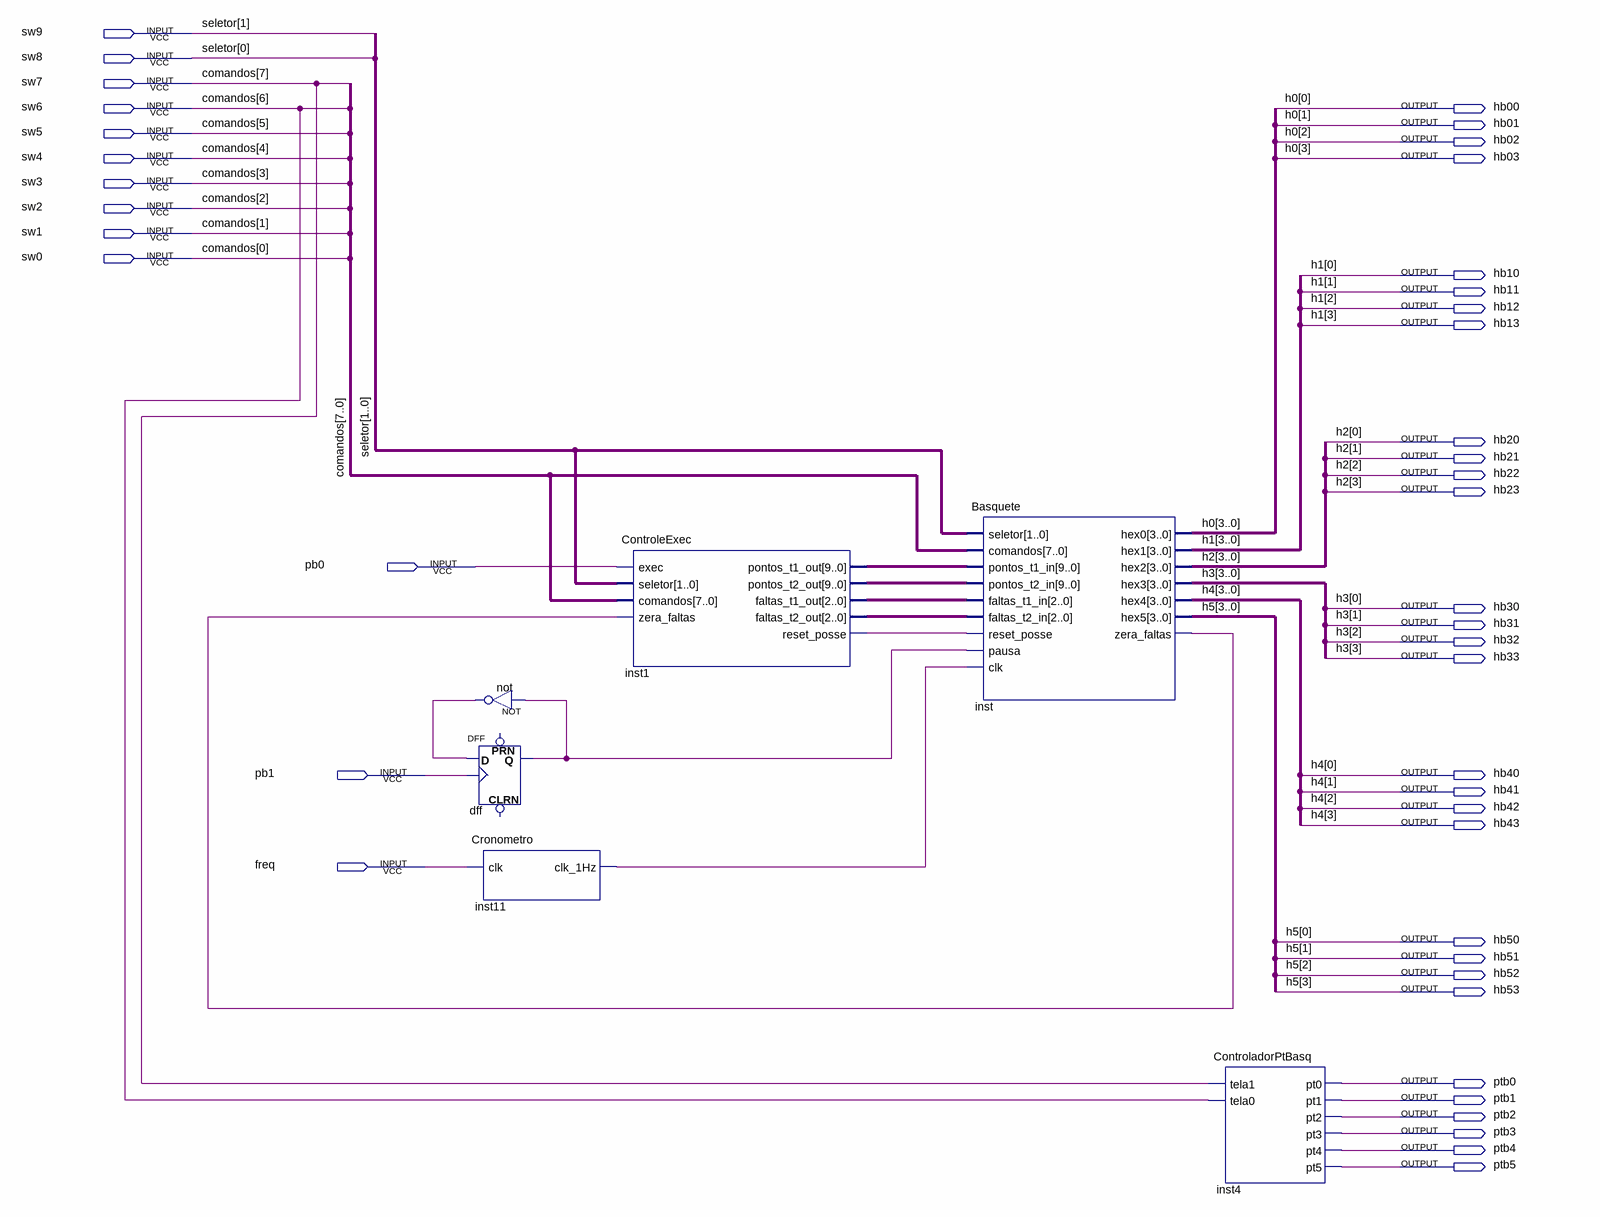
[diagram p0: schematic sheet]
// Quartus schematic ControleBasquete.bdf as structural Verilog: 6 symbols, 43 pins
module ControleBasquete (
  input  sw9,
  input  sw8,
  input  sw7,
  input  sw6,
  input  sw5,
  input  sw4,
  input  sw3,
  input  sw2,
  input  sw1,
  input  sw0,
  input  pb0,
  input  pb1,
  input  freq,
  output hb00,
  output hb01,
  output hb02,
  output hb03,
  output hb10,
  output hb11,
  output hb12,
  output hb13,
  output hb20,
  output hb21,
  output hb22,
  output hb23,
  output hb30,
  output hb31,
  output hb32,
  output hb33,
  output hb40,
  output hb41,
  output hb42,
  output hb43,
  output hb50,
  output hb51,
  output hb52,
  output hb53,
  output ptb0,
  output ptb1,
  output ptb2,
  output ptb3,
  output ptb4,
  output ptb5
);

  wire dff_q, inst1_reset_posse, inst11_clk_1hz, inst_zera_faltas, not_out;
  wire [2:0] inst1_faltas_t1_out, inst1_faltas_t2_out;
  wire [9:0] inst1_pontos_t1_out, inst1_pontos_t2_out;

  not \not  (not_out, dff_q);
  DFF dff (.CLK(pb1), .D(not_out), .Q(dff_q));  // open: CLRN, PRN
  Cronometro inst11 (.clk(freq), .clk_1Hz(inst11_clk_1hz));
  ControleExec inst1 (
    .exec(pb0), .seletor({sw9, sw8}), .comandos({sw7, sw6, sw5, sw4, sw3, sw2, sw1, sw0}),
    .zera_faltas(inst_zera_faltas), .pontos_t1_out(inst1_pontos_t1_out), .pontos_t2_out(inst1_pontos_t2_out),
    .faltas_t1_out(inst1_faltas_t1_out), .faltas_t2_out(inst1_faltas_t2_out), .reset_posse(inst1_reset_posse));
  Basquete inst (
    .seletor({sw9, sw8}), .comandos({sw7, sw6, sw5, sw4, sw3, sw2, sw1, sw0}),
    .pontos_t1_in(inst1_pontos_t1_out), .pontos_t2_in(inst1_pontos_t2_out),
    .faltas_t1_in(inst1_faltas_t1_out), .faltas_t2_in(inst1_faltas_t2_out), .reset_posse(inst1_reset_posse),
    .pausa(dff_q), .clk(inst11_clk_1hz), .hex0({hb03, hb02, hb01, hb00}), .hex1({hb13, hb12, hb11, hb10}),
    .hex2({hb23, hb22, hb21, hb20}), .hex3({hb33, hb32, hb31, hb30}), .hex4({hb43, hb42, hb41, hb40}),
    .hex5({hb53, hb52, hb51, hb50}), .zera_faltas(inst_zera_faltas));
  ControladorPtBasq inst4 (
    .tela1(sw7), .tela0(sw6), .pt0(ptb0), .pt1(ptb1), .pt2(ptb2), .pt3(ptb3), .pt4(ptb4), .pt5(ptb5));

  // Other names for the same wires on the sheet: comandos[7:0] = {sw7, sw6, sw5, sw4, sw3, sw2, sw1, sw0};
  //   h0[3:0] = {hb03, hb02, hb01, hb00}; h1[3:0] = {hb13, hb12, hb11, hb10}; h2[3:0] = {hb23, hb22, hb21, hb20};
  //   h3[3:0] = {hb33, hb32, hb31, hb30}; h4[3:0] = {hb43, hb42, hb41, hb40}; h5[3:0] = {hb53, hb52, hb51, hb50};
  //   seletor[1:0] = {sw9, sw8}
endmodule
